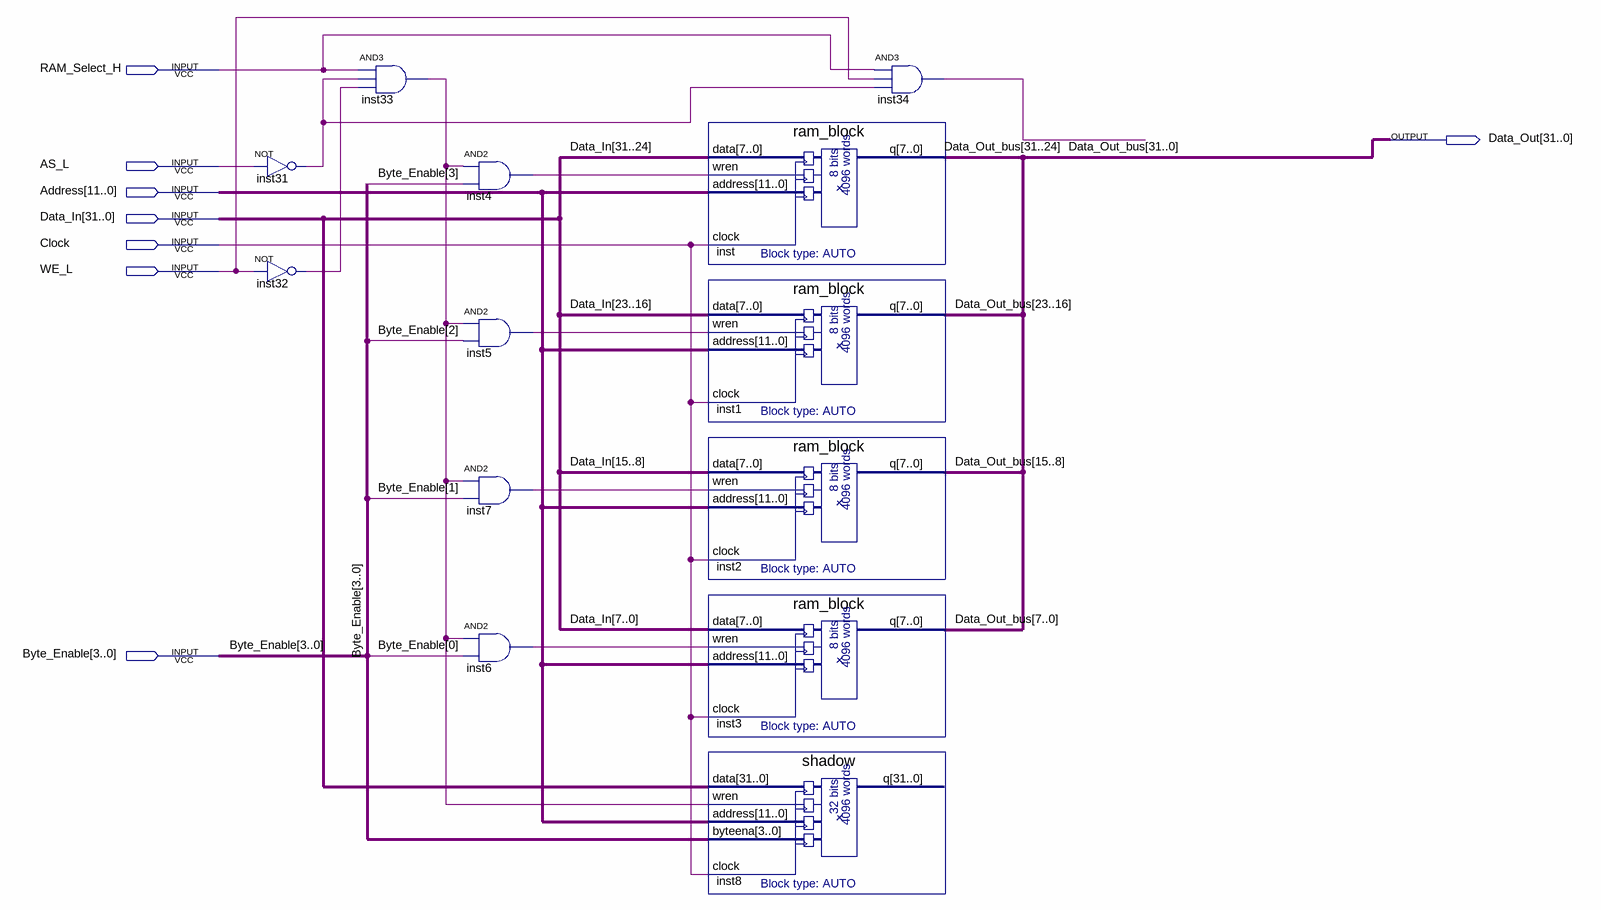
[diagram p0: schematic sheet]
// Quartus schematic SRAM_Block.bdf as structural Verilog: 13 symbols, 8 pins
module SRAM_Block (
  input  RAM_Select_H,
  input  AS_L,
  input  [11:0] Address,
  input  [31:0] Data_In,
  input  Clock,
  input  WE_L,
  input  [3:0] Byte_Enable,
  output [31:0] Data_Out
);

  wire inst4_out, inst5_out, inst6_out, inst7_out, inst31_out, inst32_out, inst33_out, inst34_out;

  not inst31 (inst31_out, AS_L);
  not inst32 (inst32_out, WE_L);
  and inst33 (inst33_out, RAM_Select_H, inst31_out, inst32_out);
  and inst4 (inst4_out, inst33_out, Byte_Enable[3]);
  and inst5 (inst5_out, inst33_out, Byte_Enable[2]);
  and inst7 (inst7_out, inst33_out, Byte_Enable[1]);
  and inst6 (inst6_out, inst33_out, Byte_Enable[0]);
  ram_block inst (.data(Data_In[31:24]), .wren(inst4_out), .address(Address), .clock(Clock), .q(Data_Out[31:24]));
  ram_block inst1 (.data(Data_In[23:16]), .wren(inst5_out), .address(Address), .clock(Clock), .q(Data_Out[23:16]));
  ram_block inst2 (.data(Data_In[15:8]), .wren(inst7_out), .address(Address), .clock(Clock), .q(Data_Out[15:8]));
  ram_block inst3 (.data(Data_In[7:0]), .wren(inst6_out), .address(Address), .clock(Clock), .q(Data_Out[7:0]));
  shadow inst8 (.data(Data_In), .wren(inst33_out), .address(Address), .byteena(Byte_Enable), .clock(Clock));  // open: q
  and inst34 (inst34_out, RAM_Select_H, WE_L, inst31_out);

  // Other names for the same wires on the sheet: Data_Out_bus[31:0] = Data_Out
endmodule
